# EAGLE design senseBox-HDC1080_v22 (EAGLE 7.7.0)
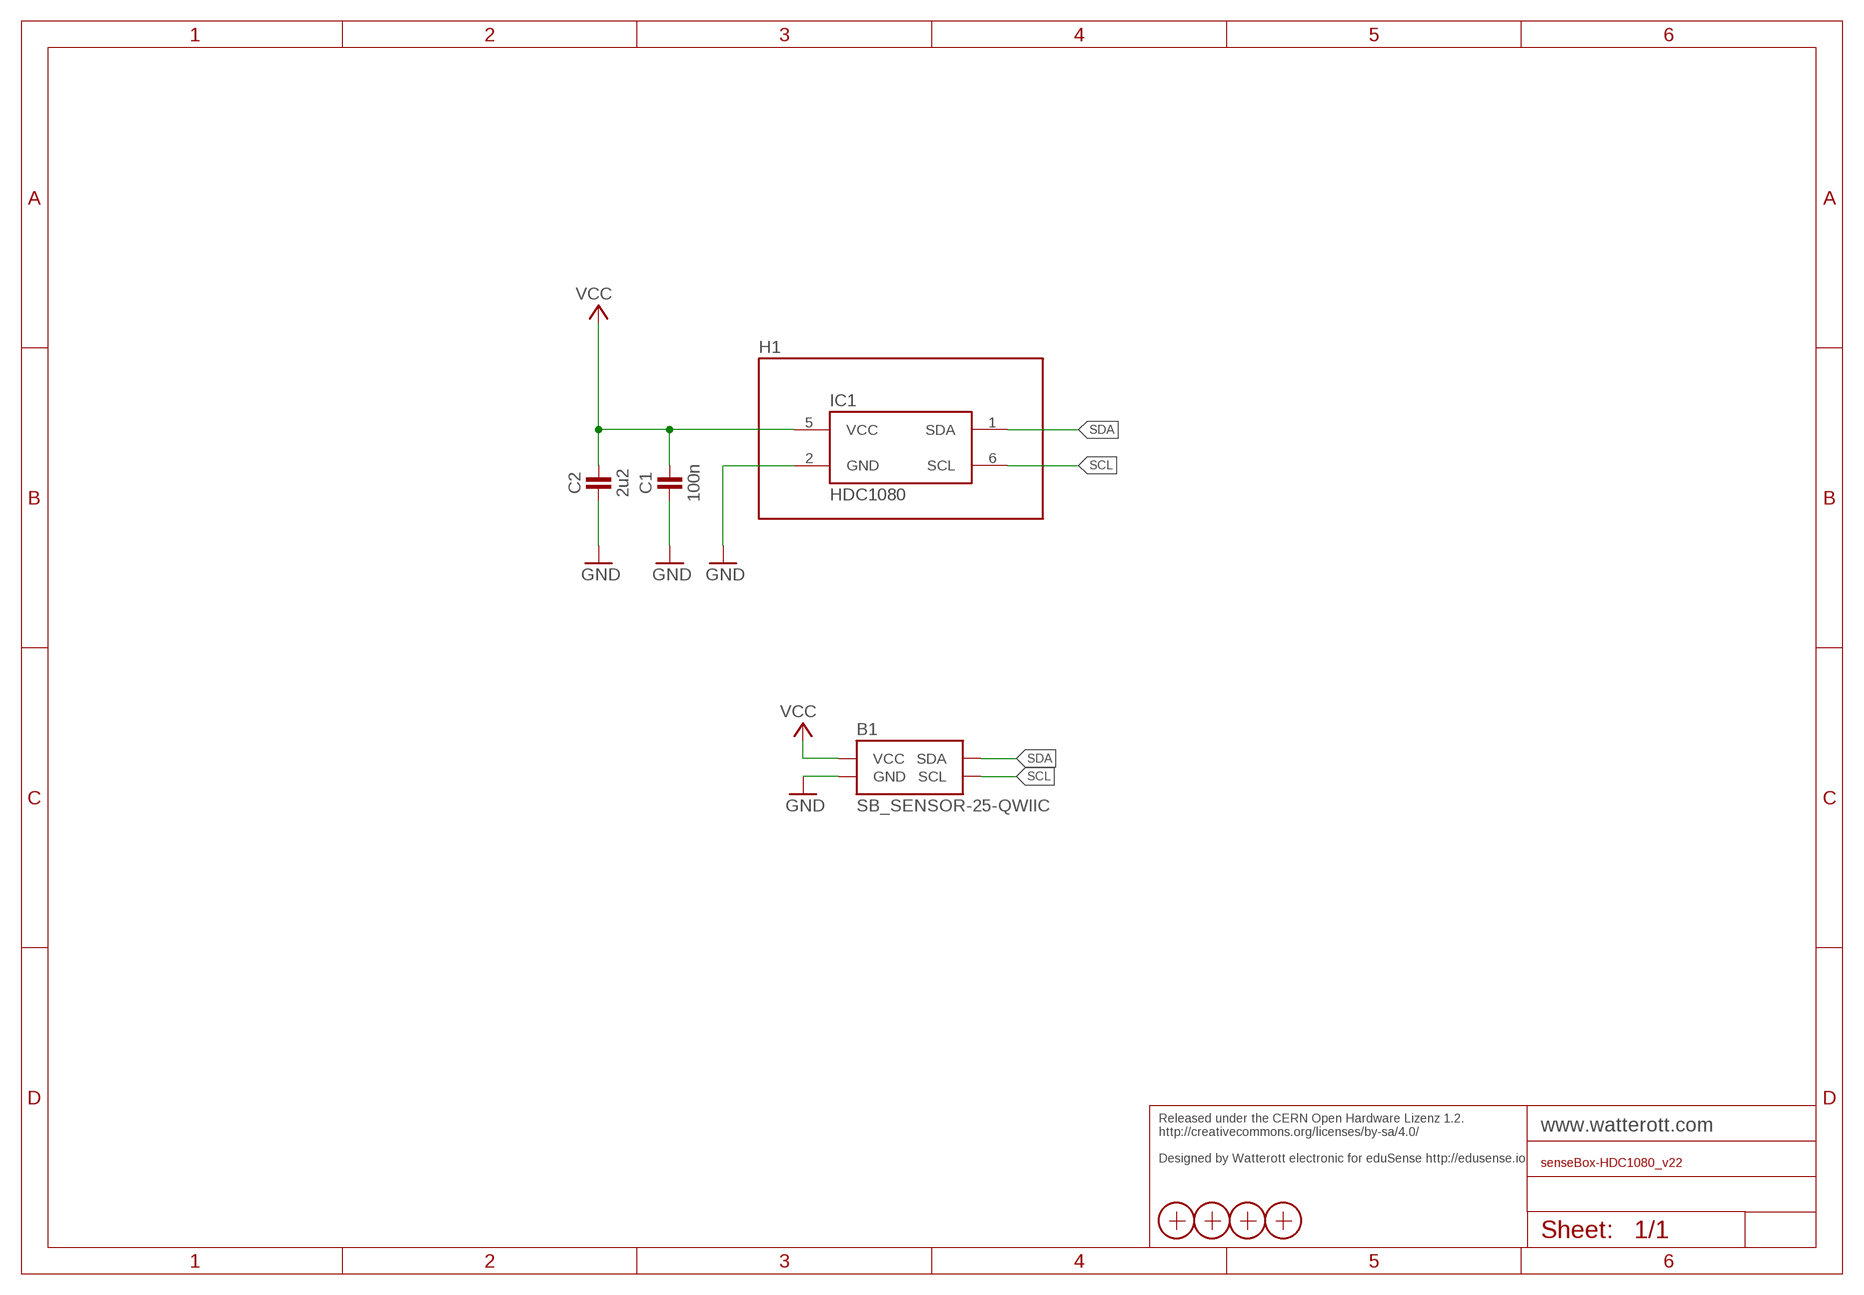
[diagram p0: schematic, sheet 1]

## Parts
B1  SB_SENSOR-25-QWIIC  [SB-25X25_QWIIC]
C1  100n  CAPACITOR-0402  [C0402]
C2  2u2  CAPACITOR-0402  [C0402]
H1  SF2  [SF2]
IC1  HDC1080  [WSON6]
X1  PASSER-07  [PASSER_07MM]
X2  PASSER-07  [PASSER_07MM]
X3  PASSER-07  [PASSER_07MM]
X4  PASSER-07  [PASSER_07MM]

## Nets
GND: B1.GND@1(GND) B1.GND@2(GND) B1.GND@3(GND) C1.1 C2.1 IC1.2(GND)
SCL: B1.SCL@1(SCL) B1.SCL@2(SCL) B1.SCL@3(SCL) IC1.6(SCL)
SDA: B1.SDA@1(SDA) B1.SDA@2(SDA) B1.SDA@3(SDA) IC1.1(SDA)
VCC: B1.VCC@1(VCC) B1.VCC@2(VCC) B1.VCC@3(VCC) C1.2 C2.2 IC1.5(VCC)

## Notes on the sheet
- Released under the CERN Open Hardware Lizenz 1.2. 
  http://creativecommons.org/licenses/by-sa/4.0/
  
  Designed by Watterott electronic for eduSense http://edusense.io

## Library data of the parts
B1 = we-board:SB_SENSOR: SenseBox Sensors/Breakouts
C1 C2 = we-rcl:CAPACITOR: Capacitors ...2.2uF @ 6.3V -> 0402 ...4.7uF @ 6.3V -> 0603 ...10uF @ 16V -> 0805 ...22uF @ 25V -> 1206
H1 = we-sensor:SF2: Housing for Sensor (BME680)
IC1 = we-sensor:HDC1080: TI HDC1080 Humidity and Temperature Sensor
X1-X4 = we-symbol:PASSER: Fiducial Markers

## Board
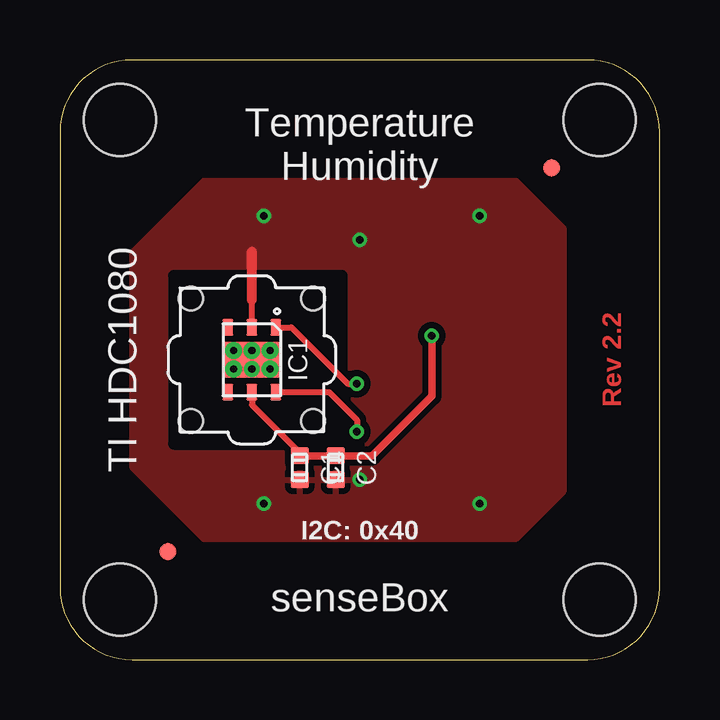
[diagram p1: board, top side]
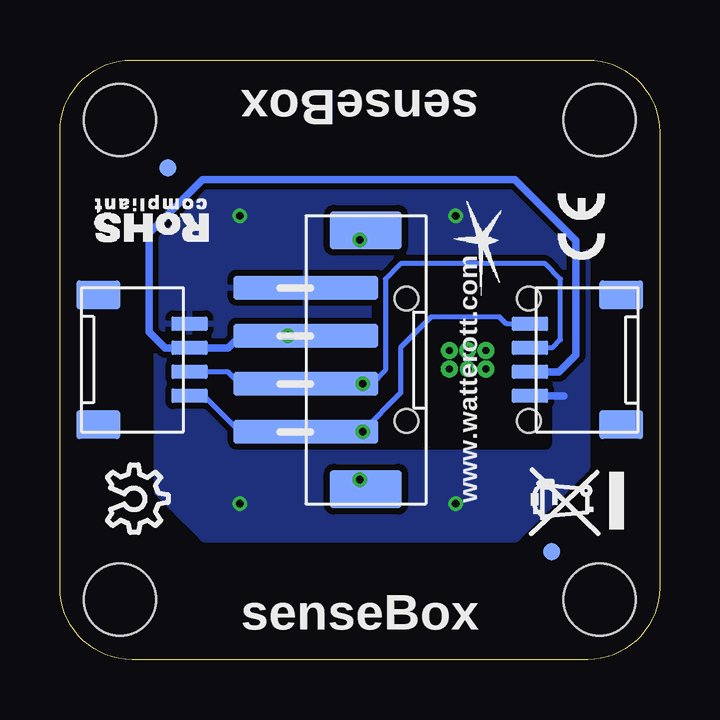
[diagram p2: board, bottom side, seen from below]

Size 25 x 25 mm. Coordinates in mm from the lower left corner, seen from the top.
Copper layers (1*16): Top 0.035mm / dielectric 1.5mm / Bottom 0.035mm
Design rules "we-dru-2-layer": minimum track width 6mil, minimum drill 0.3mm, track to track 6mil, track to pad 7mil, pad to pad 8mil, via to via 8mil, smd to smd 4mil, copper to edge 0.4mm, drill to drill 0.4mm, minimum pad ring 0.18mm, minimum via ring 0.16mm, stop-mask expansion 0.1mm, vias tented up to drill 0.5mm, thermal gap 0.25mm
tRestrict: area 4.8,9 to 11.8,16
bRestrict: area 4.8,9 to 11.8,16

### Footprints (pad centres in the part's own frame; a part is rotated, then mirrored left to right if it is on the bottom)
SB-25X25_QWIIC = smd 6 x 1 bottom: GND@1 14.746,15.5; SCL@1 14.746,9.5; SDA@1 14.746,11.5; VCC@1 14.746,13.5 | smd 1.5 x 0.6 bottom: GND@2 5.4,11; GND@3 19.6,14; SCL@2 5.4,14; SCL@3 19.6,11; SDA@2 5.4,13; SDA@3 19.6,12; VCC@2 5.4,12; VCC@3 19.6,13 | smd 3 x 1.6 bottom: SHLD1 12.246,17.9; SHLD2 12.246,7.1 | smd 1.8 x 1.2 bottom: SHLD3 1.6,15.2; SHLD4 1.6,9.8; SHLD5 23.4,15.2; SHLD6 23.4,9.8 | hole 3: 2.5,22.5; 2.5,2.5; 22.5,22.5; 22.5,2.5
C0402 = smd 0.75 x 0.7: 1 0,0.5; 2 0,-0.5
SF2 = hole 1: -2.55,-2.55; 2.55,-2.55; 2.55,2.55; -2.55,2.55
WSON6 = smd 0.7 x 0.45: 1 -1.35,1; 2 -1.35,0; 3 -1.35,-1; 4 1.35,-1; 5 1.35,0; 6 1.35,1 | drill 0.3 pad 0.7: P$2 -0.381,0.762; P$3 0.381,0.762; P$4 -0.381,0; P$5 -0.381,-0.762; P$7 0.381,-0.762 | drill 0.3 pad 0.61: P$6 0.381,0 | smd 1.5 x 2.4: TP 0,0
PASSER_07MM = smd 0.7 x 0.7: X 0,0

### Placement (x,y rotation side)
B1  0,0 0 top
C1  10,8 180 top
C2  11.5,8 180 top
H1  8,12.5 0 top
IC1  8,12.5 270 top
X1  20.5,20.5 0 top
X2  4.5,4.5 0 top
X3  4.5,4.5 0 bottom
X4  20.5,20.5 0 bottom

### Tracks (layer width: path | path; a pad name or v marks a point on that pad's centre or on a via)
GND  (via drill 0.3)
  Top 0.254: IC1.2 8,15
  Top 0.406: 8,15 8,17
  Bottom 0.305: B1.GND@2 4,11
  other vias: 17.5,18.5 17.5,6.5 8.5,6.5 8.5,18.5 12.5,17.5 12.5,7.5
  pour Top (isolate 0.254): 3,17 6,20 19,20 21,18 21,7 19,5 6,5 3,8
  pour Bottom (isolate 0.254): 3,17 6,20 19,20 21,18 21,7 19,5 6,5 3,8
SCL  (via drill 0.3)
  Top 0.254: IC1.6 11.22,11.15 12.38,10 v12.38,9.5
  Bottom 0.2: 12.41,9.5 B1.SCL@1 17.5,9.5 19,11 B1.SCL@3 | 12.41,9.5 v12.38,9.5 | 12.41,9.5 10.79,11.11 10.79,13.02 9.53,14.29 6.67,14.29 6.38,14 B1.SCL@2
SDA  (via drill 0.3)
  Top 0.254: IC1.1 9.65,13.85 12,11.5 v12.38,11.5
  Bottom 0.2: B1.SDA@3 18,12 17.5,11.5 B1.SDA@1 v12.38,11.5 11.99,11.5 11.43,12.06 11.43,15.88 10.79,16.51 4.76,16.51 4.13,15.88 4.13,13.34 4.45,13.02 5.38,13.02 B1.SDA@2
VCC  (via drill 0.3)
  Top 0.254: IC1.5 8,10.62 10,8.62 C1.2
  Top 0.305: C1.2 C2.2 13,8.5 15.5,11 v15.5,13.5
  Bottom 0.305: B1.VCC@2 4.19,12 3.49,12.7 3.49,17.46 6.03,20 19.05,20 21.27,17.78 21.27,13.65 20.62,13 B1.VCC@3 18,13 17.5,13.5 B1.VCC@1 v15.5,13.5

### Text on the board
Top: Rev 2.2
tPlace: Temperature / Humidity | TI HDC1080 | I2C: 0x40 | senseBox
Reference: 21 tPlace + 22 bPlace